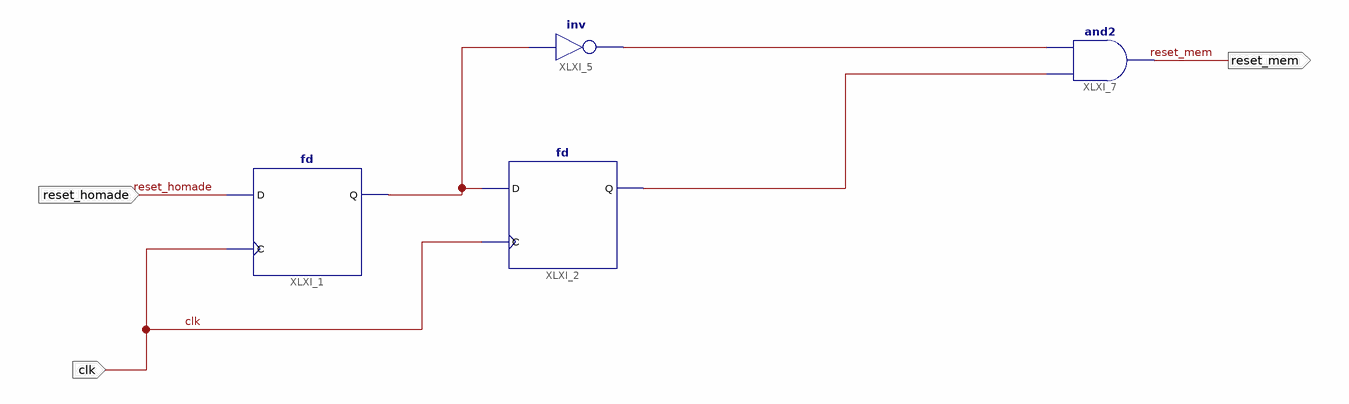
[diagram p0: schematic sheet 1]
// Xilinx ISE schematic reset_mem.sch (spartan6) as structural Verilog: 4 symbols, 3 ports
module reset_mem (
  input  clk,
  input  reset_homade,
  output reset_mem
);

  wire XLXN_13, XLXN_14, XLXN_22;

  fd XLXI_1 (.C(clk), .D(reset_homade), .Q(XLXN_14));
  fd XLXI_2 (.C(clk), .D(XLXN_14), .Q(XLXN_22));
  not XLXI_5 (XLXN_13, XLXN_14);
  and XLXI_7 (reset_mem, XLXN_22, XLXN_13);
endmodule
